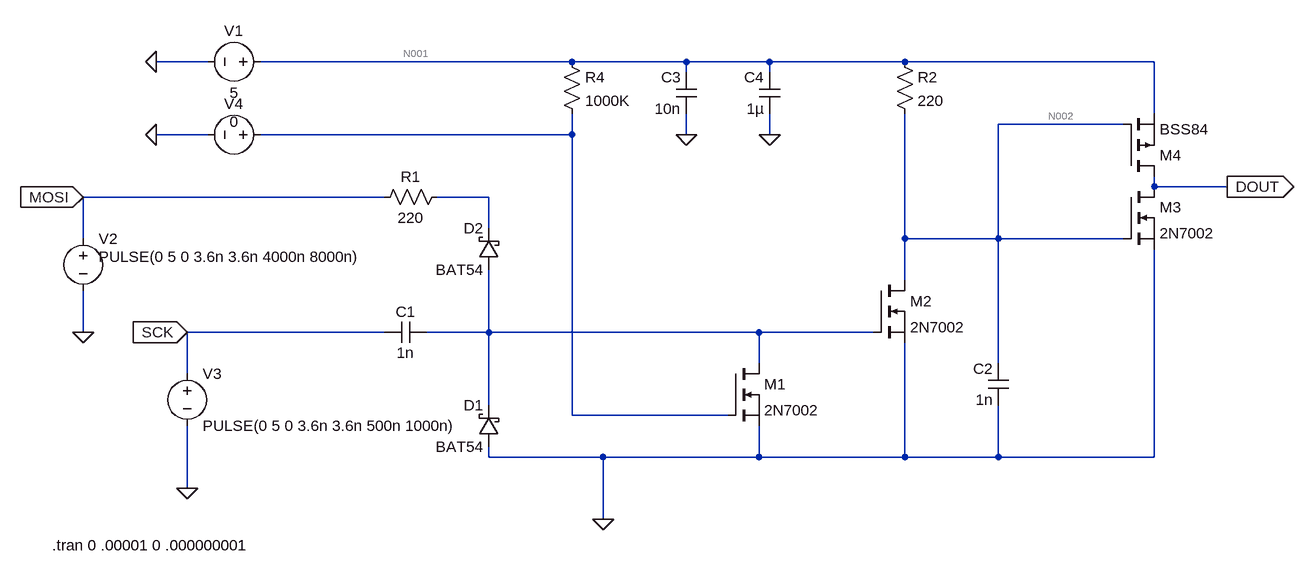
[diagram p0: schematic SimuLTSpice.asc]
SimuLTSpice.asc, the LTspice schematic file:
Version 4
SHEET 1 1564 680
WIRE -320 -96 -400 -96
WIRE 240 -96 -240 -96
WIRE 416 -96 240 -96
WIRE 544 -96 416 -96
WIRE 752 -96 544 -96
WIRE 1136 -96 752 -96
WIRE 416 -80 416 -96
WIRE 544 -80 544 -96
WIRE 1136 -16 1136 -96
WIRE 1088 0 896 0
WIRE -320 16 -400 16
WIRE 240 16 240 -16
WIRE 240 16 -240 16
WIRE 416 16 416 -16
WIRE 544 16 544 -16
WIRE 1136 96 1136 80
WIRE 1248 96 1136 96
WIRE -48 112 -512 112
WIRE 112 112 32 112
WIRE 112 160 112 112
WIRE -512 176 -512 112
WIRE 752 176 752 -16
WIRE 896 176 896 0
WIRE 896 176 752 176
WIRE 1088 176 896 176
WIRE 752 240 752 176
WIRE -512 320 -512 256
WIRE -48 320 -352 320
WIRE 112 320 112 224
WIRE 112 320 16 320
WIRE 528 320 112 320
WIRE 704 320 528 320
WIRE 528 368 528 320
WIRE 896 368 896 176
WIRE -352 384 -352 320
WIRE 112 432 112 320
WIRE 240 448 240 16
WIRE 480 448 240 448
WIRE 112 512 112 496
WIRE 288 512 112 512
WIRE 528 512 528 464
WIRE 528 512 288 512
WIRE 752 512 752 336
WIRE 752 512 528 512
WIRE 896 512 896 432
WIRE 896 512 752 512
WIRE 1136 512 1136 192
WIRE 1136 512 896 512
WIRE -352 560 -352 464
WIRE 288 608 288 512
FLAG 288 608 0
FLAG 544 16 0
FLAG 416 16 0
FLAG -512 112 MOSI
IOPIN -512 112 In
FLAG -352 320 SCK
IOPIN -352 320 In
FLAG 1248 96 DOUT
IOPIN 1248 96 Out
FLAG -400 -96 0
FLAG -352 560 0
FLAG -512 320 0
FLAG -400 16 0
SYMBOL schottky 128 496 R180
WINDOW 0 24 64 Left 2
WINDOW 3 24 0 Left 2
SYMATTR InstName D1
SYMATTR Value BAT54
SYMATTR Description Diode
SYMATTR Type diode
SYMBOL schottky 128 224 R180
WINDOW 0 24 64 Left 2
WINDOW 3 24 0 Left 2
SYMATTR InstName D2
SYMATTR Value BAT54
SYMATTR Description Diode
SYMATTR Type diode
SYMBOL res 48 96 R90
WINDOW 0 0 56 VBottom 2
WINDOW 3 32 56 VTop 2
SYMATTR InstName R1
SYMATTR Value 220
SYMBOL res 736 -112 R0
SYMATTR InstName R2
SYMATTR Value 220
SYMBOL cap 16 304 R90
WINDOW 0 0 32 VBottom 2
WINDOW 3 32 32 VTop 2
SYMATTR InstName C1
SYMATTR Value 1n
SYMBOL cap 912 432 R180
WINDOW 0 24 56 Left 2
WINDOW 3 24 8 Left 2
SYMATTR InstName C2
SYMATTR Value 1n
SYMBOL cap 432 -16 R180
WINDOW 0 24 56 Left 2
WINDOW 3 24 8 Left 2
SYMATTR InstName C3
SYMATTR Value 10n
SYMBOL cap 560 -16 R180
WINDOW 0 24 56 Left 2
WINDOW 3 24 8 Left 2
SYMATTR InstName C4
SYMATTR Value 1µ
SYMBOL res 224 -112 R0
SYMATTR InstName R4
SYMATTR Value 1000K
SYMBOL pmos 1088 80 M180
SYMATTR InstName M4
SYMATTR Value BSS84
SYMBOL nmos 1088 96 R0
SYMATTR InstName M3
SYMATTR Value 2N7002
SYMBOL nmos 704 240 R0
SYMATTR InstName M2
SYMATTR Value 2N7002
SYMBOL nmos 480 368 R0
SYMATTR InstName M1
SYMATTR Value 2N7002
SYMBOL voltage -224 -96 R90
WINDOW 0 -32 56 VBottom 2
WINDOW 3 32 56 VTop 2
WINDOW 123 0 0 Left 0
WINDOW 39 0 0 Left 0
SYMATTR InstName V1
SYMATTR Value 5
SYMBOL voltage -512 160 R0
WINDOW 3 24 44 Left 2
WINDOW 123 0 0 Left 0
WINDOW 39 0 0 Left 0
SYMATTR Value PULSE(0 5 0 3.6n 3.6n 4000n 8000n)
SYMATTR InstName V2
SYMBOL voltage -352 368 R0
WINDOW 123 0 0 Left 0
WINDOW 39 0 0 Left 0
SYMATTR InstName V3
SYMATTR Value PULSE(0 5 0 3.6n 3.6n 500n 1000n)
SYMBOL voltage -224 16 R90
WINDOW 0 -32 56 VBottom 2
WINDOW 3 -4 56 VBottom 2
WINDOW 123 0 0 Left 0
WINDOW 39 0 0 Left 0
SYMATTR InstName V4
SYMATTR Value 0
TEXT -560 648 Left 2 !.tran 0 .00001 0 .000000001

The netlist it stands for:
* SimuLTSpice.asc
D1 0 N005 BAT54
D2 N005 N004 BAT54
R1 N004 MOSI 220
R2 N001 N002 220
C1 N005 SCK 1n
C2 0 N002 1n
C3 0 N001 10n
C4 0 N001 1µ
R4 N001 N003 1000K
M4 DOUT N002 N001 N001 BSS84
M3 DOUT N002 0 0 2N7002
M2 N002 N005 0 0 2N7002
M1 N005 N003 0 0 2N7002
V1 N001 0 5
V2 MOSI 0 PULSE(0 5 0 3.6n 3.6n 4000n 8000n)
V3 SCK 0 PULSE(0 5 0 3.6n 3.6n 500n 1000n)
V4 N003 0 0
.model D D
.lib standard.dio
.model NMOS NMOS
.model PMOS PMOS
.lib standard.mos
.tran 0 .00001 0 .000000001
.backanno
.end

* Results of the author's LTspice run, read from the files saved beside the schematic
* Operating Point, zero values left out:
*   V(n001) = 5 V
*   V(n002) = 5 V
*   Id(M2) = 5.031 pA
*   Is(M2) = -5.031 pA
*   Id(M3) = 12 pA
*   Is(M3) = -12 pA
*   Id(M4) = -7 pA
*   Is(M4) = 7 pA
*   I(R4) = 5 µA
*   I(R2) = 10.04 pA
*   I(V4) = 5 µA
*   I(V1) = -5 µA